# EasyEDA schematic SCH_OSHW_BiDi_SDI_Fiber_Converter_V3_2024-11-17.json
TITLE: Sheet_1; REV: 1.0; Date: 2024-07-08; Sheet: 1/1; Drawn By: TheStaticTurtle; Company: Your Company
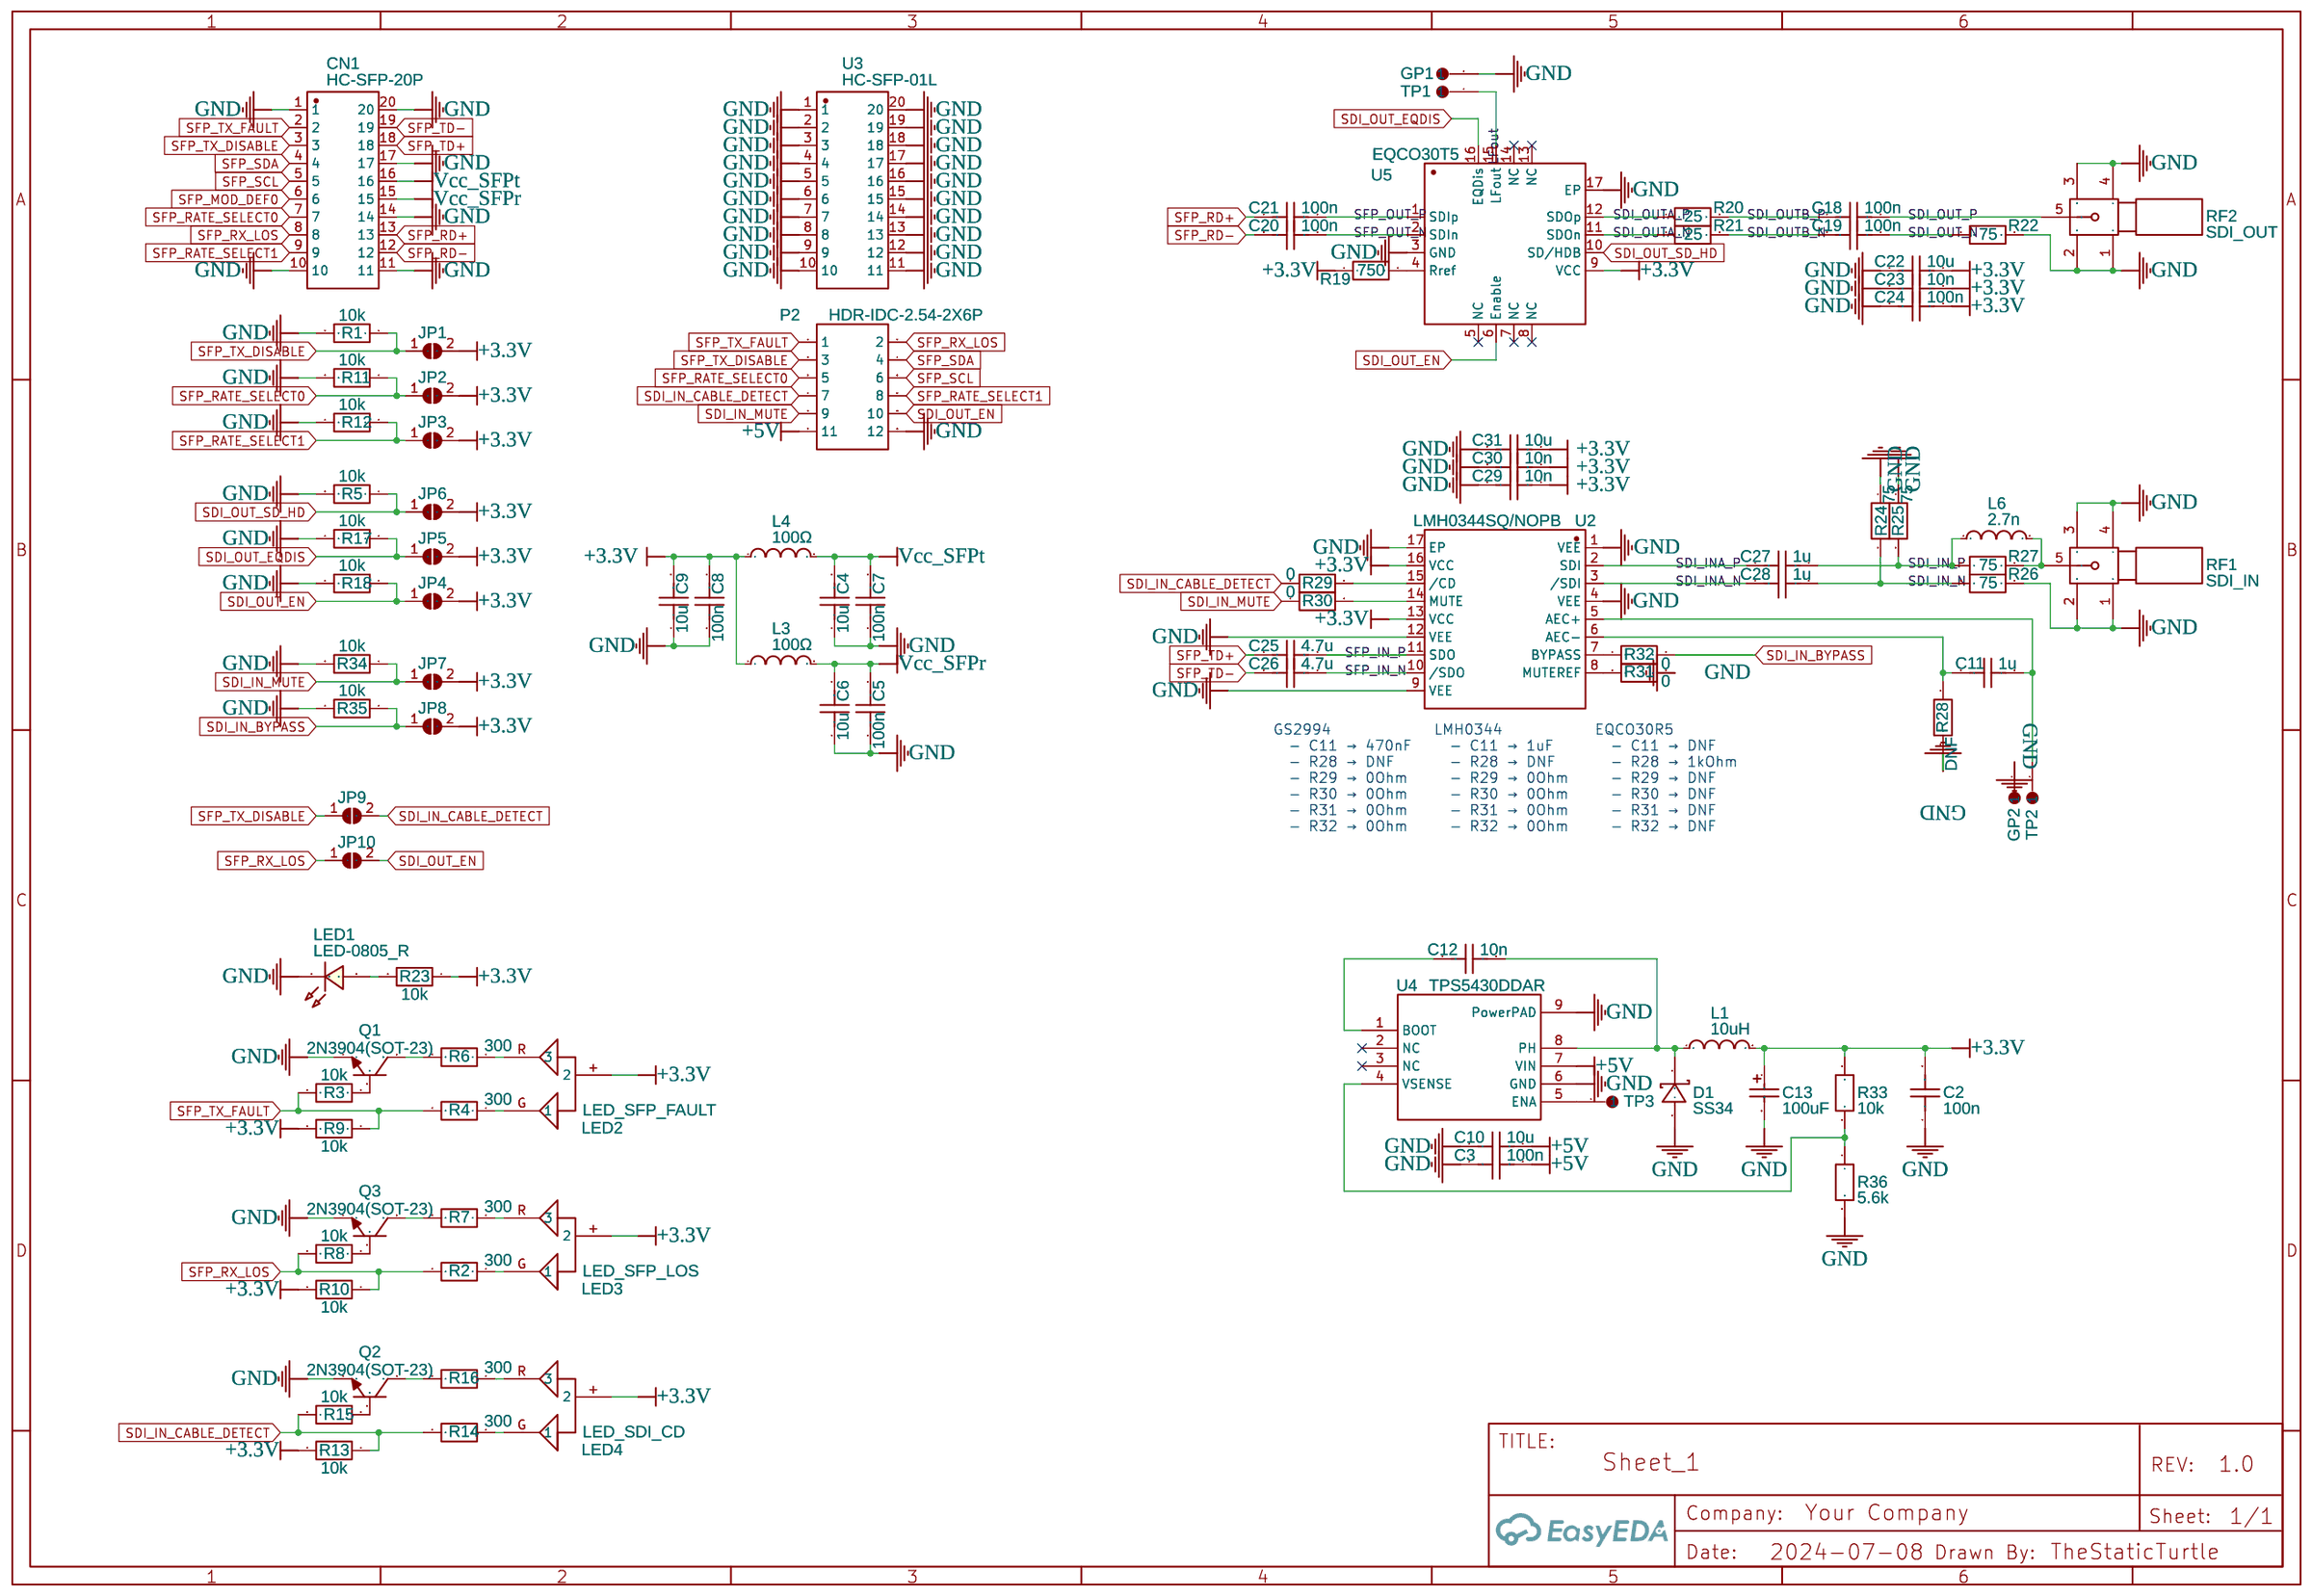
[diagram p0: schematic sheet]

## Parts
C2  100n  [C0603]
C3  100n  [C0603]
C4  10u  [C0603]
C5  100n  [C0603]
C6  10u  [C0603]
C7  100n  [C0603]
C8  100n  [C0603]
C9  10u  [C0603]
C10  10u  [C0603]
C11  1u  [C0603]
C12  10n  [C0603]
C13  100uF  [CASE-B_3528]
C18  100n  [C0603]
C19  100n  [C0603]
C20  100n  [C0603]
C21  100n  [C0603]
C22  10u  [C0603]
C23  10n  [C0603]
C24  100n  [C0603]
C25  4.7u  [C0603]
C26  4.7u  [C0603]
C27  1u  [C0603]
C28  1u  [C0603]
C29  10n  [C0603]
C30  10n  [C0603]
C31  10u  [C0603]
CN1  HC-SFP-20P  [CONN-SMD_20P-P0.80_HCTL_HC-SFP-20P]
D1  SS34  [SMA_L4.3-W2.6-LS5.2-RD]
GP1  TEST-POINT-PTH-1X1  [TESTPOINT-SMD_L1.6-W0.8_RCU-0C]
GP2  TEST-POINT-PTH-1X1  [TESTPOINT-SMD_L1.6-W0.8_RCU-0C]
JP1  SOLDER BRIDGE  [SOLDER BRIDGE 2P BRIDGED]
JP2  SOLDER BRIDGE  [SOLDER BRIDGE 2P BRIDGED]
JP3  SOLDER BRIDGE  [SOLDER BRIDGE 2P BRIDGED]
JP4  SOLDER BRIDGE  [SOLDER BRIDGE 2P BRIDGED]
JP5  SOLDER BRIDGE  [SOLDER BRIDGE 2P BRIDGED]
JP6  SOLDER BRIDGE  [SOLDER BRIDGE 2P BRIDGED]
JP7  SOLDER BRIDGE  [SOLDER BRIDGE 2P BRIDGED]
JP8  SOLDER BRIDGE  [SOLDER BRIDGE 2P BRIDGED]
JP9  SOLDER BRIDGE  [SOLDER BRIDGE 2P BRIDGED]
JP10  SOLDER BRIDGE  [SOLDER BRIDGE 2P BRIDGED]
L1  10uH  [IND-SMD_L4.0-W4.0]
L3  100Ω  [L0805]
L4  100Ω  [L0805]
L6  2.7n  [L0603]
LED1  LED-0805_R  [LED0805_RED]
LED2  LED_SFP_FAULT  [LED RED/GREEN]
LED3  LED_SFP_LOS  [LED RED/GREEN]
LED4  LED_SDI_CD  [LED RED/GREEN]
P2  HDR-IDC-2.54-2X6P  [IDC-TH_12P-P2.54_BOOMELE-2X6P-2.54MM]
Q1  2N3904(SOT-23)  [SOT-23-3_L2.9-W1.3-P1.90-LS2.4-TR]
Q2  2N3904(SOT-23)  [SOT-23-3_L2.9-W1.3-P1.90-LS2.4-TR]
Q3  2N3904(SOT-23)  [SOT-23-3_L2.9-W1.3-P1.90-LS2.4-TR]
R1  10k  [R0603]
R2  300  [R0603]
R3  10k  [R0603]
R4  300  [R0603]
R5  10k  [R0603]
R6  300  [R0603]
R7  300  [R0603]
R8  10k  [R0603]
R9  10k  [R0603]
R10  10k  [R0603]
R11  10k  [R0603]
R12  10k  [R0603]
R13  10k  [R0603]
R14  300  [R0603]
R15  10k  [R0603]
R16  300  [R0603]
R17  10k  [R0603]
R18  10k  [R0603]
R19  750  [R0603]
R20  25  [R0603]
R21  25  [R0603]
R22  75  [R0603]
R23  10k  [R0603]
R24  75  [R0603]
R25  75  [R0603]
R26  75  [R0603]
R27  75  [R0603]
R28  DNF  [R0603]
R29  0  [R0402]
R30  0  [R0402]
R31  0  [R0402]
R32  0  [R0402]
R33  10k  [R0603]
R34  10k  [R0603]
R35  10k  [R0603]
R36  5.6k  [R0603]
RF1  SDI_IN  [SMA-SMD_BWSMA-KE-P001]
RF2  SDI_OUT  [SMA-SMD_BWSMA-KE-P001]
TP1  TEST-POINT-PTH-1X1  [TESTPOINT-SMD_L1.6-W0.8_RCU-0C]
TP2  TEST-POINT-PTH-1X1  [TESTPOINT-SMD_L1.6-W0.8_RCU-0C]
TP3  TEST-POINT-PTH-1X1  [TESTPOINT-SMD_L1.6-W0.8_RCU-0C]
U2  LMH0344SQ/NOPB  [QFN-16_L4.0-W4.0-P0.65-BL-EP2.6]
U3  HC-SFP-01L  [TH_HC-SFP-01L]
U4  TPS5430DDAR  [ESOP-8_L4.9-W3.9-P1.27-LS6.0-TL-EP]
U5  EQCO30T5  [QFN16G-0.65-4X4MM]

## Library data of the parts
C2-C12 C18-C31 = C_0603_US: Contributor: LCEDA_Lib
C13 = TAJB107K006RNJ: Supplier: LCSC; Manufacturer: Kyocera AVX; Supplier Part: C16133; JLCPCB Part Class: Basic Part
CN1 = HC-SFP-20P: Contributor: LCSC; Supplier: LCSC; Supplier Part: C2897291; Manufacturer: HCTL(华灿天禄); JLCPCB Part Class: Extended Part
D1 = SS34_C8678: Supplier: LCSC; Manufacturer: MDD(辰达半导体); Supplier Part: C8678
GP1 GP2 TP1-TP3 = TEST-POINT-PTH-1X1
JP1-JP10 = SOLDER BRIDGE: Contributor: Luka Hierl
L1 = SWPA4030S100MT: Supplier: LCSC; Manufacturer: Sunlord(顺络); Supplier Part: C38117; JLCPCB Part Class: Extended Part
L3 L4 = GZ2012D101TF: Supplier: LCSC; Manufacturer: Sunlord(顺络); Supplier Part: C1015; JLCPCB Part Class: Basic Part
L6 = L0603_US: Contributor: LCEDA_Lib
LED1 = LED-0805_R: Manufacturer: EVERLIGHT(台湾亿光); Manufacturer Part: 17-21SURC/S530-A3/TR8; Supplier Part: C72037; Contributor: LCEDA_Lib
LED2-LED4 = LED RED/GREEN CA: Contributor: Longhorn450
P2 = HDR-IDC-2.54-2X6P: Supplier: LCSC; Manufacturer: BOOMELE; Manufacturer Part: IDC Box 2X6 2.54MM; Supplier Part: C9136
Q1-Q3 = 2N3904(SOT-23): Supplier: LCSC; Manufacturer: KEC; Manufacturer Part: 2n3904S-RTK/PS; Supplier Part: C18536; Paste Type: SOT-23; Contributor: LCEDA_Lib
R1-R28 R31 R33-R36 = R_0603_EU: Contributor: LCEDA_Lib
R29 R30 R32 = R_0402_EU: Contributor: LCEDA_Lib
RF1 RF2 = BWSMA-KE-P001: Supplier: LCSC; Supplier Part: C496550; Manufacturer: BAT WIRELESS; Contributor: ytahn23
U2 = LMH0344SQ/NOPB: Contributor: LCSC; Supplier: LCSC; Supplier Part: C191792; Manufacturer: TI(德州仪器); JLCPCB Part Class: Extended Part
U3 = HC-SFP-01L: Contributor: LCSC; Supplier: LCSC; Supplier Part: C2897292; Manufacturer: HCTL(华灿天禄); JLCPCB Part Class: Extended Part
U4 = TPS5430DDAR: Supplier: LCSC; Manufacturer: TI(德州仪器); Supplier Part: C9864; JLCPCB Part Class: Basic Part
U5 = EQCO30T5: Manufacturer: Microchip; link: https://www.microchip.com/en-us/product/eqco30r5; Contributor: turtleforgaming

## Nets
+3.3V: C2.2 C8.2 C9.2 C13.1 C22.2 C23.2 C24.2 C29.2 C30.2 C31.2 JP1.2(B) JP2.2(B) JP3.2(B) JP4.2(B) JP5.2(B) JP6.2(B) JP7.2(B) JP8.2(B) L1.2 L3.1 L4.1 LED2.+(2) LED3.+(2) LED4.+(2) R9.2 R10.2 R13.2 R19.1 R23.1 R33.1 U2.13(VCC) U2.16(VCC) U5.9(VCC)
+5V: C3.2 C10.2 P2.11 U4.7(VIN)
GND: C2.1 C3.1 C4.1 C5.1 C6.1 C7.1 C8.1 C9.1 C10.1 C13.2 C22.1 C23.1 C24.1 C29.1 C30.1 C31.1 CN1.1 CN1.10 CN1.11 CN1.14 CN1.17 CN1.20 D1.2(A) GP1.1 GP2.1 LED1.2 P2.12 Q1.1(E) Q2.1(E) Q3.1(E) R1.2 R5.2 R11.2 R12.2 R17.2 R18.2 R22.2 R24.1 R25.1 R26.2 R28.1 R31.1 R34.2 R35.2 R36.2 RF1.1 RF1.2 RF1.3 RF1.4 RF2.1 RF2.2 RF2.3 RF2.4 U2.1(VEE) U2.4(VEE) U2.9(VEE) U2.12(VEE) U2.17(EP) U3.1 U3.2 U3.3 U3.4 U3.5 U3.6 U3.7 U3.8 U3.9 U3.10 U3.11 U3.12 U3.13 U3.14 U3.15 U3.16 U3.17 U3.18 U3.19 U3.20 U4.6(GND) U4.9(PowerPAD) U5.3(GND) U5.17(EP)
Vcc_SFPr: C5.2 C6.2 CN1.15 L3.2
Vcc_SFPt: C4.2 C7.2 CN1.16 L4.2
LFout: TP1.1 U5.15(LFout)
SDI_IN_BYPASS: JP8.1(A) R32.2 R35.1
SDI_IN_CABLE_DETECT: JP9.2(B) P2.7 R13.1 R14.2 R15.2 R29.1
SDI_IN_MUTE: JP7.1(A) P2.9 R30.1 R34.1
SDI_IN_N: C28.2 R24.2 R26.1
SDI_IN_P: C27.2 L6.1 R25.2 R27.1
SDI_INA_N: C28.1 U2.3(/SDI)
SDI_INA_P: C27.1 U2.2(SDI)
SDI_OUT_EN: JP4.1(A) JP10.2(B) P2.10 R18.1 U5.6(Enable)
SDI_OUT_EQDIS: JP5.1(A) R17.1 U5.16(EQDis)
SDI_OUT_N: C19.2 R22.1
SDI_OUT_P: C18.2 RF2.5
SDI_OUT_SD_HD: JP6.1(A) R5.1 U5.10(SD/HDB)
SDI_OUTA_N: R21.1 U5.11(SDOn)
SDI_OUTA_P: R20.1 U5.12(SDOp)
SDI_OUTB_N: C19.1 R21.2
SDI_OUTB_P: C18.1 R20.2
SFP_IN_N: C26.2 U2.10(/SDO)
SFP_IN_P: C25.2 U2.11(SDO)
SFP_MOD_DEF0: CN1.6
SFP_OUT_N: C20.2 U5.2(SDIn)
SFP_OUT_P: C21.2 U5.1(SDIp)
SFP_RATE_SELECT0: CN1.7 JP2.1(A) P2.5 R11.1
SFP_RATE_SELECT1: CN1.9 JP3.1(A) P2.8 R12.1
SFP_RD+: C21.1 CN1.13
SFP_RD-: C20.1 CN1.12
SFP_RX_LOS: CN1.8 JP10.1(A) P2.2 R2.2 R8.2 R10.1
SFP_SCL: CN1.5 P2.6
SFP_SDA: CN1.4 P2.4
SFP_TD+: C25.1 CN1.18
SFP_TD-: C26.1 CN1.19
SFP_TX_DISABLE: CN1.3 JP1.1(A) JP9.1(A) P2.3 R1.1
SFP_TX_FAULT: CN1.2 P2.1 R3.2 R4.2 R9.1
Net-(C11-1): C11.1 R28.2 U2.6(AEC-)
Net-(C11-2): C11.2 TP2.1 U2.5(AEC+)
Net-(C12-1): C12.1 U4.1(BOOT)
Net-(C12-2): C12.2 D1.1(K) L1.1 U4.8(PH)
Net-(L6-2): L6.2 R27.2 RF1.5
Net-(LED1-1): LED1.1 R23.2
Net-(LED2-G): LED2.G(1) R4.1
Net-(LED2-R): LED2.R(3) R6.1
Net-(LED3-G): LED3.G(1) R2.1
Net-(LED3-R): LED3.R(3) R7.1
Net-(LED4-G): LED4.G(1) R14.1
Net-(LED4-R): LED4.R(3) R16.1
Net-(Q1-2): Q1.2(B) R3.1
Net-(Q1-3): Q1.3(C) R6.2
Net-(Q2-2): Q2.2(B) R15.1
Net-(Q2-3): Q2.3(C) R16.2
Net-(Q3-2): Q3.2(B) R8.1
Net-(Q3-3): Q3.3(C) R7.2
Net-(R19-2): R19.2 U5.4(Rref)
Net-(R29-2): R29.2 U2.15(/CD)
Net-(R30-2): R30.2 U2.14(MUTE)
Net-(R31-2): R31.2 U2.8(MUTEREF)
Net-(R32-1): R32.1 U2.7(BYPASS)
Net-(R33-2): R33.2 R36.1 U4.4(VSENSE)
Net-(TP3-1): TP3.1 U4.5(ENA)

Not connected (* = marked no-connect by the designer): U4 2(NC)* 3(NC)*; U5 5(NC)* 7(NC)* 8(NC)* 13(NC)* 14(NC)*

## Notes on the sheet
- GS2994
    - C11 → 470nF
    - R28 → DNF
    - R29 → 0Ohm
    - R30 → 0Ohm
    - R31 → 0Ohm
    - R32 → 0Ohm
- LMH0344
    - C11 → 1uF
    - R28 → DNF
    - R29 → 0Ohm
    - R30 → 0Ohm
    - R31 → 0Ohm
    - R32 → 0Ohm
- EQCO30R5
    - C11 → DNF
    - R28 → 1kOhm
    - R29 → DNF
    - R30 → DNF
    - R31 → DNF
    - R32 → DNF
